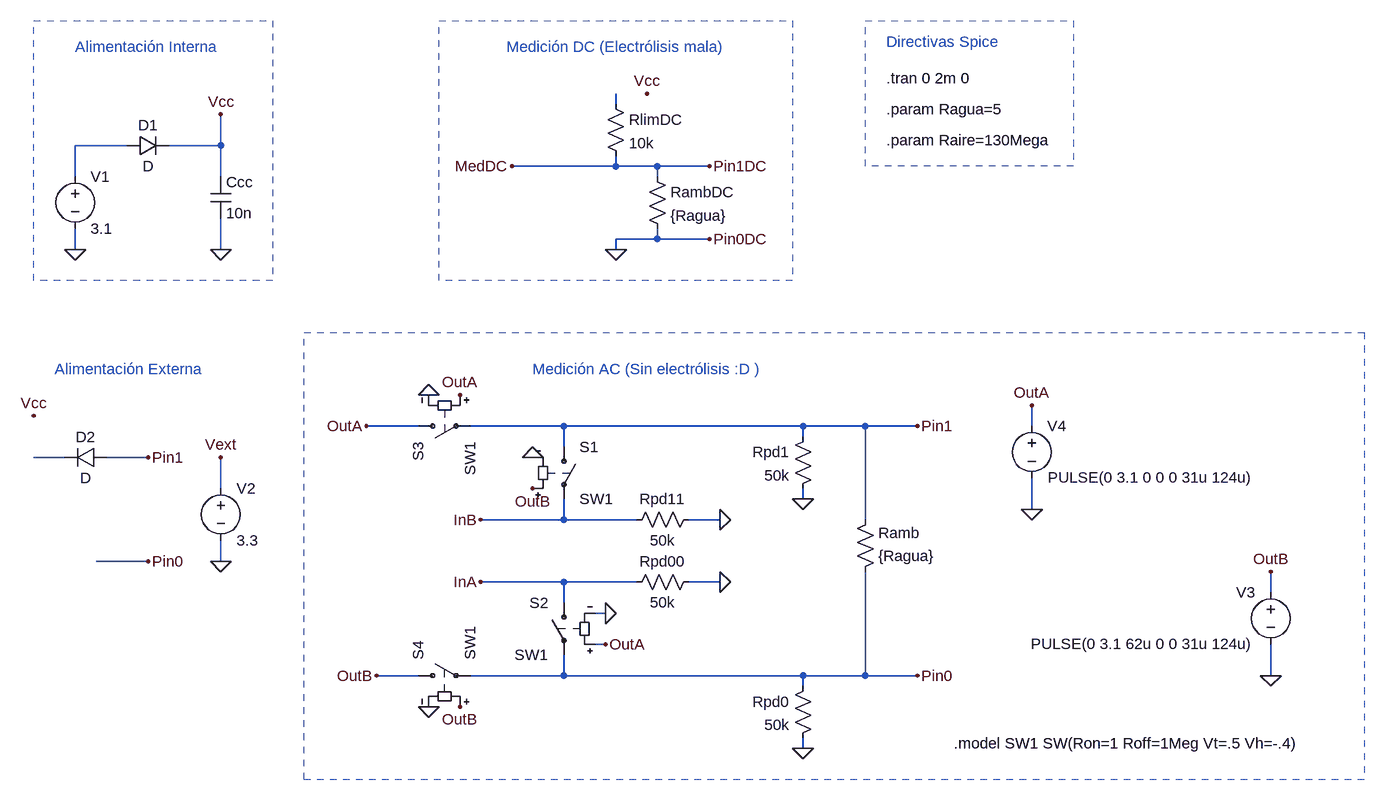
[diagram p0: schematic Simu_conductividad.asc]
Simu_conductividad.asc, the LTspice schematic file:
Version 4
SHEET 1 1864 980
WIRE 224 -64 224 -80
WIRE -528 0 -608 0
WIRE -384 0 -384 -48
WIRE -384 0 -464 0
WIRE 224 32 224 16
WIRE 224 32 64 32
WIRE 288 32 224 32
WIRE 368 32 288 32
WIRE -608 48 -608 0
WIRE -384 48 -384 0
WIRE 288 48 288 32
WIRE 288 144 288 128
WIRE 288 144 224 144
WIRE 368 144 288 144
WIRE -608 160 -608 128
WIRE -384 160 -384 112
WIRE 224 160 224 144
WIRE -80 432 -160 432
WIRE 144 432 0 432
WIRE 512 432 144 432
WIRE 608 432 512 432
WIRE 688 432 608 432
WIRE 864 432 864 400
WIRE 512 448 512 432
WIRE 144 464 144 432
WIRE -624 480 -672 480
WIRE -496 480 -560 480
WIRE -384 528 -384 480
WIRE 512 544 512 528
WIRE 864 560 864 512
WIRE 144 576 144 544
WIRE 144 576 16 576
WIRE 256 576 144 576
WIRE 384 576 336 576
WIRE 608 576 608 432
WIRE -496 640 -576 640
WIRE -384 640 -384 608
WIRE 144 672 16 672
WIRE 256 672 144 672
WIRE 384 672 336 672
WIRE 1232 688 1232 656
WIRE 144 704 144 672
WIRE 208 720 192 720
WIRE 208 768 192 768
WIRE -80 816 -144 816
WIRE 144 816 144 784
WIRE 144 816 0 816
WIRE 512 816 144 816
WIRE 608 816 608 656
WIRE 608 816 512 816
WIRE 688 816 608 816
WIRE 1232 816 1232 768
WIRE 512 832 512 816
WIRE 512 928 512 912
FLAG -384 -48 Vcc
FLAG -384 160 0
FLAG -608 160 0
FLAG 224 160 0
FLAG 64 32 MedDC
FLAG 272 -80 Vcc
FLAG 688 816 Pin0
FLAG 688 432 Pin1
FLAG 864 400 OutA
FLAG 864 560 0
FLAG 512 544 0
FLAG 512 928 0
FLAG 368 32 Pin1DC
FLAG 368 144 Pin0DC
FLAG -672 416 Vcc
FLAG -496 480 Pin1
FLAG -496 640 Pin0
FLAG -144 816 OutB
FLAG -160 432 OutA
FLAG 1232 656 OutB
FLAG 1232 816 0
FLAG -16 384 OutA
FLAG 208 768 OutA
FLAG 96 528 OutB
FLAG -16 864 OutB
FLAG -64 384 0
FLAG -64 864 0
FLAG 208 720 0
FLAG 96 480 0
FLAG 16 672 InA
FLAG 16 576 InB
FLAG 384 672 0
FLAG 384 576 0
FLAG -384 640 0
FLAG -384 480 Vext
SYMBOL voltage -608 32 R0
WINDOW 123 0 0 Left 0
WINDOW 39 0 0 Left 0
SYMATTR InstName V1
SYMATTR Value 3.1
SYMBOL diode -528 16 R270
WINDOW 0 32 32 VTop 2
WINDOW 3 0 32 VBottom 2
SYMATTR InstName D1
SYMBOL cap -400 48 R0
SYMATTR InstName Ccc
SYMATTR Value 10n
SYMBOL res 208 -80 R0
SYMATTR InstName RlimDC
SYMATTR Value 10k
SYMBOL res 272 32 R0
SYMATTR InstName RambDC
SYMATTR Value {Ragua}
SYMBOL res 592 672 M180
WINDOW 0 36 76 Left 2
WINDOW 3 36 40 Left 2
SYMATTR InstName Ramb
SYMATTR Value {Ragua}
SYMBOL voltage 864 416 R0
WINDOW 3 25 95 Left 2
WINDOW 123 0 0 Left 0
WINDOW 39 0 0 Left 0
SYMATTR Value PULSE(0 3.1 0 0 0 31u 124u)
SYMATTR InstName V4
SYMBOL res 528 432 M0
SYMATTR InstName Rpd1
SYMATTR Value 50k
SYMBOL res 528 816 M0
SYMATTR InstName Rpd0
SYMATTR Value 50k
SYMBOL voltage -384 512 R0
WINDOW 123 0 0 Left 0
WINDOW 39 0 0 Left 0
SYMATTR InstName V2
SYMATTR Value 3.3
SYMBOL diode -560 464 R90
WINDOW 0 0 32 VBottom 2
WINDOW 3 32 32 VTop 2
SYMATTR InstName D2
SYMBOL voltage 1232 672 M0
WINDOW 3 25 95 Left 2
WINDOW 123 0 0 Left 0
WINDOW 39 0 0 Left 0
SYMATTR Value PULSE(0 3.1 62u 0 0 31u 124u)
SYMATTR InstName V3
SYMBOL sw 144 448 R0
SYMATTR InstName S1
SYMATTR Value SW1
SYMBOL sw 144 688 M0
SYMATTR InstName S2
SYMATTR Value SW1
SYMBOL sw -96 432 M90
SYMATTR InstName S3
SYMATTR Value SW1
SYMBOL sw -96 816 R270
SYMATTR InstName S4
SYMATTR Value SW1
SYMBOL res 352 656 R90
WINDOW 0 0 56 VBottom 2
WINDOW 3 32 56 VTop 2
SYMATTR InstName Rpd00
SYMATTR Value 50k
SYMBOL res 352 560 R90
WINDOW 0 0 56 VBottom 2
WINDOW 3 32 56 VTop 2
SYMATTR InstName Rpd11
SYMATTR Value 50k
TEXT 640 -104 Left 2 !.tran 0 2m 0
TEXT 56 -152 Left 2 ;Medición DC (Electrólisis mala)
TEXT 96 344 Left 2 ;Medición AC (Sin electrólisis :D )
TEXT -608 -152 Left 2 ;Alimentación Interna
TEXT 640 -160 Left 2 ;Directivas Spice
TEXT 640 -56 Left 2 !.param Ragua=5
TEXT 640 -8 Left 2 !.param Raire=130Mega
TEXT 744 920 Left 2 !.model SW1 SW(Ron=1 Roff=1Meg Vt=.5 Vh=-.4)
TEXT -640 344 Left 2 ;Alimentación Externa
RECTANGLE Normal -304 208 -672 -192 2
RECTANGLE Normal 496 208 -48 -192 2
RECTANGLE Normal 1376 976 -256 288 2
RECTANGLE Normal 928 32 608 -192 2

The netlist it stands for:
* Simu_conductividad.asc
V1 N002 0 3.1
D1 N002 Vcc D
Ccc Vcc 0 10n
RlimDC N001 Pin1DC 10k
RambDC Pin1DC 0 {Ragua}
Ramb Pin0 Pin1 {Ragua}
V4 OutA 0 PULSE(0 3.1 0 0 0 31u 124u)
Rpd1 Pin1 0 50k
Rpd0 Pin0 0 50k
V2 Vext 0 3.3
D2 Pin1 N003 D
V3 OutB 0 PULSE(0 3.1 62u 0 0 31u 124u)
S1 Pin1 InB OutB 0 SW1
S2 InA Pin0 OutA 0 SW1
S3 OutA Pin1 OutA 0 SW1
S4 OutB Pin0 OutB 0 SW1
Rpd00 0 InA 50k
Rpd11 0 InB 50k
.model D D
.lib standard.dio
.tran 0 2m 0
* Medición DC (Electrólisis mala)
* Medición AC (Sin electrólisis :D )
* Alimentación Interna
* Directivas Spice
.param Ragua=5
.param Raire=130Mega
.model SW1 SW(Ron=1 Roff=1Meg Vt=.5 Vh=-.4)
* Alimentación Externa
.backanno
.end